# Altium schematic sheet HollowKnightSchematic.SchDoc
size A4
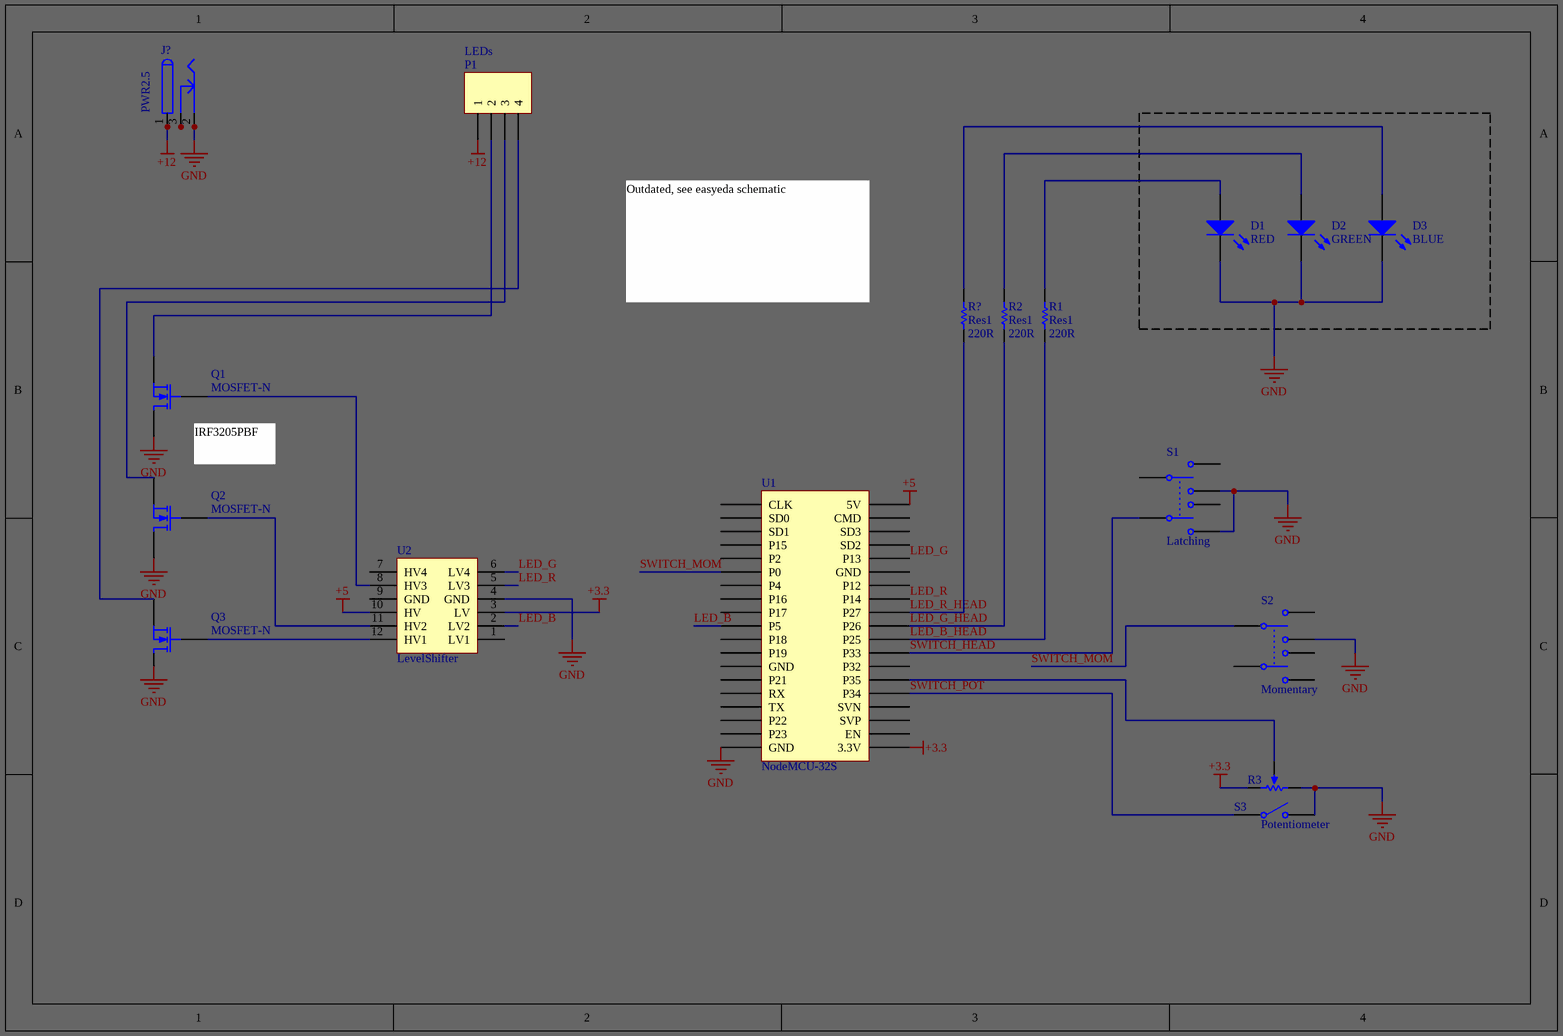
[diagram p0: HollowKnightSchematic.SchDoc]

## Parts
D1  RED  [LED-0]
D2  GREEN  [LED-0]
D3  BLUE  [LED-0]
J?  PWR2.5  [KLD-0202]
P1  LEDs  [HDR1X4]
Q1  MOSFET-N  [E3]
Q2  MOSFET-N  [E3]
Q3  MOSFET-N  [E3]
R1  Res1  value 220R  [AXIAL-0.3]
R2  Res1  value 220R  [AXIAL-0.3]
R3  RPot  [VR5]  (value not drawn)
R?  Res1  value 220R  [AXIAL-0.3]
S1  Latching  [DPDT-6]
S2  Momentary  [DPDT-6]
S3  Potentiometer  [SPST-2]
U1  NodeMCU-32S  [DIP36]
U2  LevelShifter  [LevelShifter]

## Nets
+3.3: R3.2(BOT) U1.20(3.3V) U2.3(LV)
+5: U1.38(5V) U2.10(HV)
+12: J?.1 J?.1A J?.1B P1.1
GND: D1.2(K) D2.2(K) D3.2(K) J?.2 J?.2A J?.2B Q1.1(D) Q2.1(D) R3.1(TOP) S1.3 S1.6 S2.3 S3.2(NO) U1.19(GND) U2.4(GND)
LED_B: U1.10(P5) U2.2(LV2)
LED_B_HEAD: R1.2 U1.28(P25)
LED_G: U1.34(P13) U2.6(LV4)
LED_G_HEAD: R2.2 U1.29(P26)
LED_R: U1.31(P14) U2.5(LV3)
LED_R_HEAD: R?.2 U1.30(P27)
SWITCH_HEAD: S1.4 U1.27(P33)
SWITCH_MOM: S2.1 U1.6(P0)
SWITCH_POT: S3.1(COMMON) U1.24(P34)
NetD1_1: D1.1(A) R1.1
NetD2_1: D2.1(A) R2.1
NetD3_1: D3.1(A) R?.1
NetJ?_3: J?.3 J?.3A J?.3B
NetP1_2: P1.2 Q1.3(S)
NetP1_3: P1.3 Q2.3(S)
NetP1_4: P1.4 Q3.3(S)
NetQ1_2: Q1.2(G) U2.8(HV3)
NetQ2_2: Q2.2(G) U2.11(HV2)
NetQ3_2: Q3.2(G) U2.12(HV1)
NetR3_3: R3.3(TAP) U1.25(P35)

Not connected (* = marked no-connect by the designer): Q3 1(D); S1 1 2 5; S2 2 4 5 6; U1 1(CLK) 2(SD0) 3(SD1) 4(P15) 5(P2) 7(P4) 8(P16) 9(P17) 11(P18) 12(P19) 13(GND) 14(P21) 15(RX) 16(TX) 17(P22) 18(P23) 21(EN) 22(SVP) 23(SVN) 26(P32) 32(P12) 33(GND) 35(SD2) 36(SD3) 37(CMD); U2 1(LV1) 7(HV4) 9(GND)

## Notes on the sheet
- Outdated, see easyeda schematic
- (near Q1) IRF3205PBF
- Labels drawn without touching a wire or pin: GND

## Library data of the parts
D1-D3 = LED0: Typical INFRARED GaAs LED; Published: 8-Jun-2000; LatestRevisionDate: 08-Jul-2005; LatestRevisionNote: Mech Layer 1 removed.; PackageReference: LED-0; Publisher: Altium Limited; PackageDescription: LED; 2 Leads
J? = PWR2.5: Low Voltage Power Supply Connector; Published: 17-Dec-2003; DatasheetDocument: 09-May-2002; Publisher: Altium Limited; ComponentLink1Description: Manufacturer Link; ComponentLink1URL: http://domino.kycon.com/internet/Products.html
P1 = Header 4: Header, 4-Pin; LatestRevisionDate: 17-Jul-2002; LatestRevisionNote: Re-released for DXP Platform.; Publisher: Altium Limited
Q1-Q3 = MOSFET-N: N-Channel MOSFET; Published: 8-Jun-2000; LatestRevisionDate: 17-Jul-2002; LatestRevisionNote: Re-released for DXP Platform.; PackageVersion: 1995/1996; PackageReference: E3; Publisher: Altium Limited; PackageDescription: TO, Flat Index; 3 In-Line, Axial Leads; Body Dia. 4.6mm; Lead Dia. 0.5 mm (max)
R1 R2 R? = Res1: Resistor; Published: 8-Jun-2000; LatestRevisionDate: 17-Jul-2002; LatestRevisionNote: Re-released for DXP Platform.; PackageReference: AXIAL-0.3; Publisher: Altium Limited; PackageDescription: Axial Device, Thru-Hole; 2 Leads; 0.3 in Pin Spacing
R3 = RPot: Potentiometer; Sim Note: Enter the Resistance value and the set point into parameter fields.; Set Position: 0.5; Value: 1K; Published: 8-Jun-2000; LatestRevisionDate: 17-Jul-2002; LatestRevisionNote: Re-released for DXP Platform.; PackageReference: VR5; Publisher: Altium Limited; PackageDescription: Variable Resistor, Thru-Hole; 3 Leads
S1 S2 = SW-DPDT: Double-Pole, Double-Throw Switch; Published: 24-Mar-1999; LatestRevisionDate: 17-Jul-2002; LatestRevisionNote: Re-released for DXP Platform.; PackageReference: DPDT-6; Publisher: Altium Limited; PackageDescription: Switch; 6 Leads
S3 = SW-SPST: Single-Pole, Single-Throw Switch; Published: 24-Mar-1999; LatestRevisionDate: 17-Jul-2002; LatestRevisionNote: Re-released for DXP Platform.; PackageReference: SPST-2; Publisher: Altium Limited; PackageDescription: Switch; 2 Leads